# Altium schematic sheet IO Expansion.SchDoc: IO Expansion
size B; DrawnBy: Jasper Yun; SheetNumber: 5; SheetTotal: 11; Competition: SAC 2021; Subteam: Avionics; University: McGill University; Location: Montreal, Quebec; Project: Avionics Project Name; MRT: McGill Rocket Team
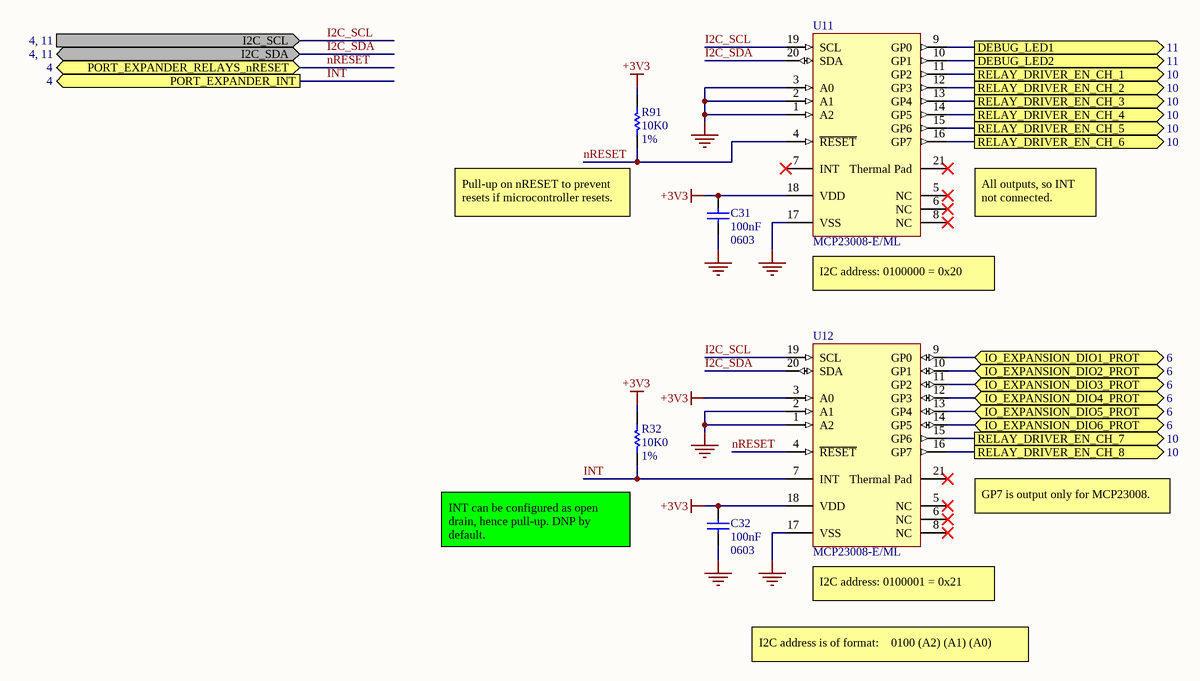
[diagram p0: IO Expansion.SchDoc]

## Parts
C31  100nF  value 0603  [0603 CAP SAMSUNG CL10C]
C32  100nF  value 0603  [0603 CAP SAMSUNG CL10C]
R32  10K0  value 1%  [0603 RES]
R91  10K0  value 1%  [0603 RES]
U11  MCP23008-E/ML  [QFN-ML20_M]
U12  MCP23008-E/ML  [QFN-ML20_M]

## Ports
DEBUG_LED1 (out, see 11), DEBUG_LED2 (out, see 11), I2C_SCL (in, see 4, 11), I2C_SDA (bidir, see 4, 11), IO_EXPANSION_DIO1_PROT (bidir, see 6), IO_EXPANSION_DIO2_PROT (bidir, see 6), IO_EXPANSION_DIO3_PROT (bidir, see 6), IO_EXPANSION_DIO4_PROT (bidir, see 6), IO_EXPANSION_DIO5_PROT (bidir, see 6), IO_EXPANSION_DIO6_PROT (bidir, see 6), PORT_EXPANDER_INT (out, see 4), PORT_EXPANDER_RELAYS_nRESET (bidir, see 4), RELAY_DRIVER_EN_CH_1 (out, see 10), RELAY_DRIVER_EN_CH_2 (out, see 10), RELAY_DRIVER_EN_CH_3 (out, see 10), RELAY_DRIVER_EN_CH_4 (out, see 10), RELAY_DRIVER_EN_CH_5 (out, see 10), RELAY_DRIVER_EN_CH_6 (out, see 10), RELAY_DRIVER_EN_CH_7 (out, see 10), RELAY_DRIVER_EN_CH_8 (out, see 10)

## Nets
+3V3: C31.2 C32.2 R32.1 R91.1 U11.18(VDD) U12.3(A0) U12.18(VDD)
GND: C31.1 C32.1 U11.1(A2) U11.2(A1) U11.3(A0) U11.17(VSS) U12.1(A2) U12.2(A1) U12.17(VSS)
DEBUG_LED1: U11.9(GP0) ; port DEBUG_LED1
DEBUG_LED2: U11.10(GP1) ; port DEBUG_LED2
I2C_SCL: U11.19(SCL) U12.19(SCL) ; port I2C_SCL
I2C_SDA: U11.20(SDA) U12.20(SDA) ; port I2C_SDA
INT: R32.2 U12.7(INT) ; port PORT_EXPANDER_INT
IO_EXPANSION_DIO1_PROT: U12.9(GP0) ; port IO_EXPANSION_DIO1_PROT
IO_EXPANSION_DIO2_PROT: U12.10(GP1) ; port IO_EXPANSION_DIO2_PROT
IO_EXPANSION_DIO3_PROT: U12.11(GP2) ; port IO_EXPANSION_DIO3_PROT
IO_EXPANSION_DIO4_PROT: U12.12(GP3) ; port IO_EXPANSION_DIO4_PROT
IO_EXPANSION_DIO5_PROT: U12.13(GP4) ; port IO_EXPANSION_DIO5_PROT
IO_EXPANSION_DIO6_PROT: U12.14(GP5) ; port IO_EXPANSION_DIO6_PROT
nRESET: R91.2 U11.4(~{RESET}) U12.4(~{RESET}) ; port PORT_EXPANDER_RELAYS_nRESET
RELAY_DRIVER_EN_CH_1: U11.11(GP2) ; port RELAY_DRIVER_EN_CH_1
RELAY_DRIVER_EN_CH_2: U11.12(GP3) ; port RELAY_DRIVER_EN_CH_2
RELAY_DRIVER_EN_CH_3: U11.13(GP4) ; port RELAY_DRIVER_EN_CH_3
RELAY_DRIVER_EN_CH_4: U11.14(GP5) ; port RELAY_DRIVER_EN_CH_4
RELAY_DRIVER_EN_CH_5: U11.15(GP6) ; port RELAY_DRIVER_EN_CH_5
RELAY_DRIVER_EN_CH_6: U11.16(GP7) ; port RELAY_DRIVER_EN_CH_6
RELAY_DRIVER_EN_CH_7: U12.15(GP6) ; port RELAY_DRIVER_EN_CH_7
RELAY_DRIVER_EN_CH_8: U12.16(GP7) ; port RELAY_DRIVER_EN_CH_8

Not connected (* = marked no-connect by the designer): U11 5(NC)* 6(NC)* 7(INT)* 8(NC)* 21(Thermal_Pad)*; U12 5(NC)* 6(NC)* 8(NC)* 21(Thermal_Pad)*

## Notes on the sheet
- (near R91) Pull-up on nRESET to prevent resets if microcontroller resets.
- All outputs, so INT not connected.
- (near U11) I2C address: 0100000 = 0x20
- (near R32) INT can be configured as open drain, hence pull-up. DNP by default.
- GP7 is output only for MCP23008.
- (near U12) I2C address: 0100001 = 0x21
- I2C address is of format:    0100 (A2) (A1) (A0)
- Title
- Size:
- Date:
- B
- Revision:
- Time:
- Drawn By:
- Sheet
- of
- File:

## Library data of the parts
C31 C32 = Cap: Capacitor; Published: 8-Jun-2000; LatestRevisionDate: 17-Jul-2002; LatestRevisionNote: Re-released for DXP Platform.; PackageReference: RAD-0.3; Publisher: Altium Limited; PackageDescription: Radial Cap, Thru-Hole; 2 Leads; 0.3 in Pin Spacing
R32 R91 = Res1: Resistor; Published: 8-Jun-2000; LatestRevisionDate: 17-Jul-2002; LatestRevisionNote: Re-released for DXP Platform.; PackageReference: AXIAL-0.3; Publisher: Altium Limited; PackageDescription: Axial Device, Thru-Hole; 2 Leads; 0.3 in Pin Spacing
U11 U12 = CMP-0186-00018-2: 8-Bit I/O Expander with Serial Interface, 20-Pin QFN, Extended Temperature; ComponentLink2URL: http://ww1.microchip.com/downloads/en/DeviceDoc/21919e.pdf; ComponentLink1Description: Manufacturer URL; ComponentLink3Description: Package Specification; ComponentLink1URL: http://www.microchip.com/; RevisionNote: URLs added.; PackageReference: QFN-ML20; ComponentLink2Description: Datasheet; PackageDescription: 20-Lead Plastic Quad Flat, No Lead Package (ML) - 4x4x0.9 mm Body [QFN]; ComponentLink3URL: http://www.microchip.com/stellent/groups/techpub_sg/documents/packagingspec/en012702.pdf; DatasheetVersion: revE, Aug-2007; PackageVersion: revBB, Aug-2009